# EAGLE design pocsagboardv2 (EAGLE 7.1.0)
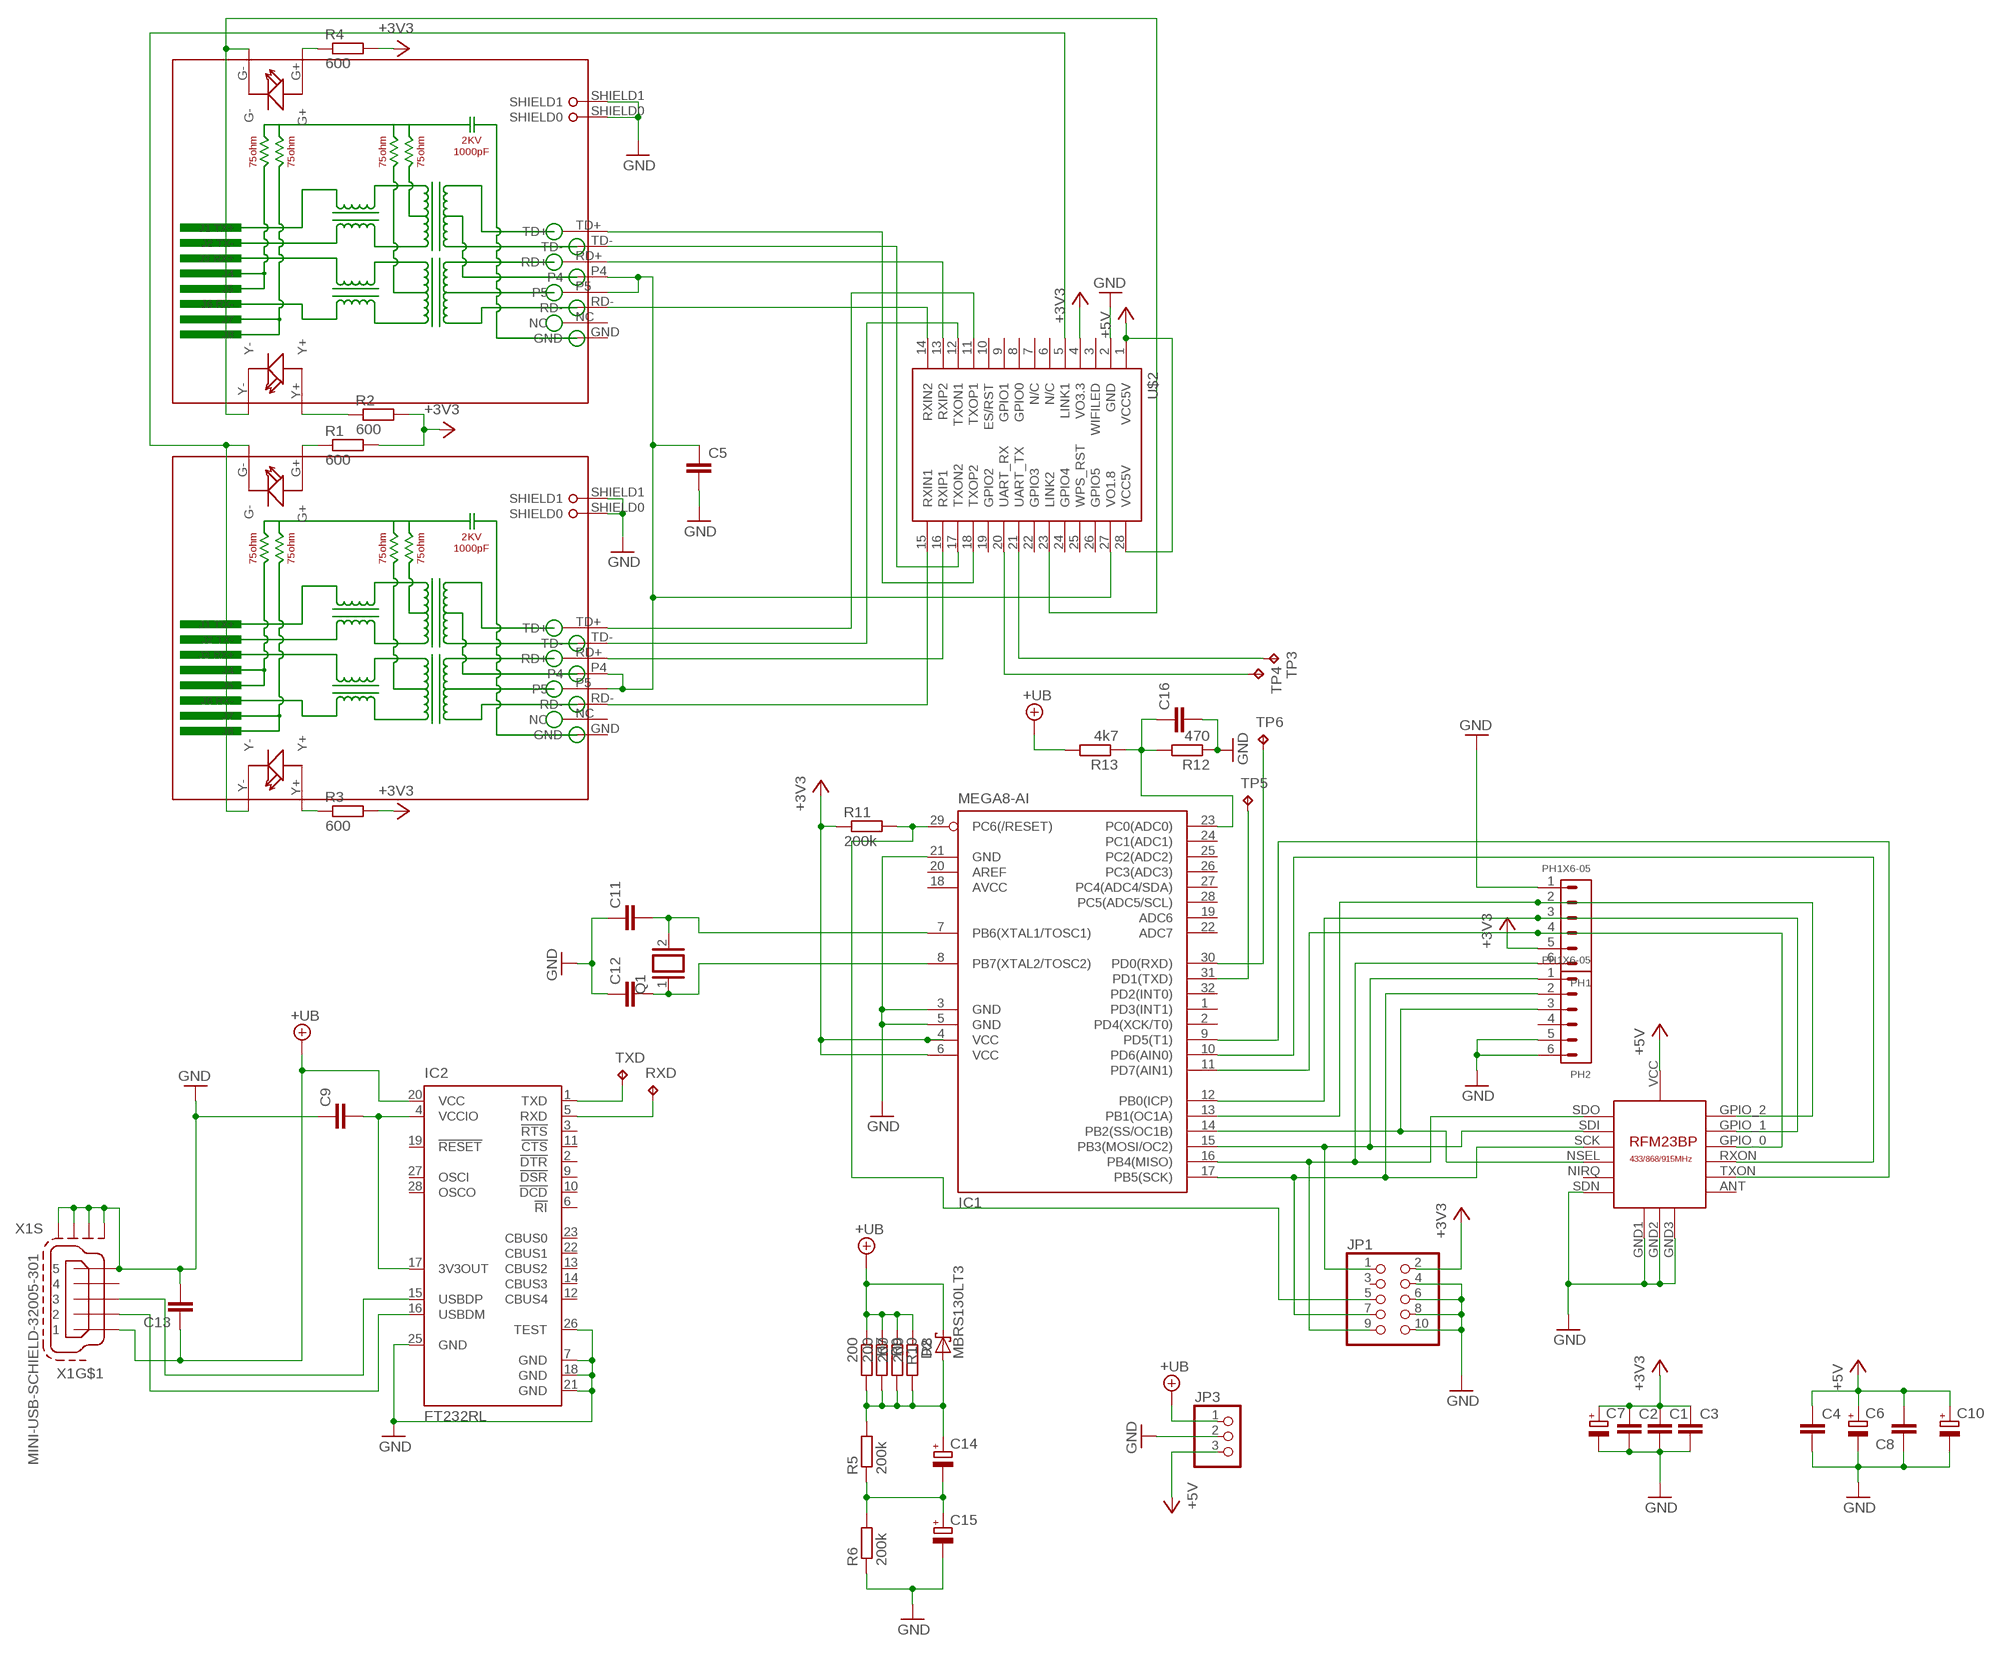
[diagram p0: schematic, sheet 1]

## Parts
C1  C-EUC1206K  [C1206K]
C2  C-EUC1206K  [C1206K]
C3  C-EUC1206K  [C1206K]
C4  C-EUC1206K  [C1206K]
C5  C-EUC1206K  [C1206K]
C6  CPOL-EU175TMP-0808  [175TMP-0808]
C7  CPOL-EU175TMP-0808  [175TMP-0808]
C8  C-EUC1206K  [C1206K]
C9  C-EUC1206K  [C1206K]
C10  CPOL-EU175TMP-0808  [175TMP-0808]
C11  C-EUC0805  [C0805]
C12  C-EUC0805  [C0805]
C13  C-EUC1206K  [C1206K]
C14  CPOL-EUSANYO_F  [SANYO-OSCON_F]
C15  CPOL-EUSANYO_F  [SANYO-OSCON_F]
C16  C-EUC1206K  [C1206K]
D2  MBRS130LT3  [SMB]
IC1  MEGA8-AI  [TQFP32-08]
IC2  FT232RL  [SSOP28]
JP1  PINHD-2X5  [2X05]
JP3  PINHD-1X3  [1X03]
PH1  PH1X6-05  [PH005-1-6]
PH2  PH1X6-05  [PH005-1-6]
Q1  XTAL/S  [QS]
R1  600  R-EU_M1206  [M1206]
R2  600  R-EU_M1206  [M1206]
R3  600  R-EU_M1206  [M1206]
R4  600  R-EU_M1206  [M1206]
R5  200k  R-EU_R1206  [R1206]
R6  200k  R-EU_R1206  [R1206]
R7  200  R-EU_R1206  [R1206]
R8  200  R-EU_R1206  [R1206]
R9  200  R-EU_R1206  [R1206]
R10  200  R-EU_R1206  [R1206]
R11  200k  R-EU_R1206  [R1206]
R12  470  R-EU_R1206  [R1206]
R13  4k7  R-EU_R1206  [R1206]
RJ1  HR911105A  [HR911105A]
RJ2  HR911105A  [HR911105A]
RXD  TPTP10SQ  [TP10SQ]
TP3  TPTP10SQ  [TP10SQ]
TP4  TPTP10SQ  [TP10SQ]
TP5  TPTP10SQ  [TP10SQ]
TP6  TPTP10SQ  [TP10SQ]
TXD  TPTP10SQ  [TP10SQ]
U$1  RFM23BP  [RFM23BP]
U$2  HLK-RM04  [HLK-RM04]
X1  MINI-USB-SCHIELD-32005-301  [32005-301]

## Nets
+3V3: C1.1 C2.1 C3.1 C7.+ IC1.4(VCC) IC1.6(VCC) JP1.2 PH1.5 R1.2 R2.2 R3.2 R4.2 R11.1 U$2.4(VO3.3)
+5V: C4.1 C6.+ C8.2 C10.+ JP3.3 U$1.VCC U$2.1(VCC5V) U$2.28(VCC5V)
+UB: C13.1 D2.C IC2.20(VCC) JP3.1 R7.1 R8.1 R9.1 R10.1 R13.2 X1.1
GND: C1.2 C2.2 C3.2 C4.2 C5.2 C6.- C7.- C8.1 C9.1 C10.- C11.1 C12.1 C13.2 C15.- C16.2 IC1.3(GND) IC1.5(GND) IC1.21(GND) IC2.7(GND) IC2.18(GND) IC2.21(GND) IC2.25(GND) IC2.26(TEST) JP1.4 JP1.6 JP1.8 JP1.10 JP3.2 PH1.1 PH2.5 PH2.6 R6.1 R12.1 RJ1.SHIELD0 RJ1.SHIELD1 RJ2.SHIELD0 RJ2.SHIELD1 U$1.GND1 U$1.GND2 U$1.GND3 U$1.SDN U$2.2(GND) X1.5 X1.M1(S:S1) X1.M2(S:S2) X1.M3(S:S3) X1.M4(S:S4)
N$1: IC1.11(PD7(AIN1)) PH1.4 U$1.GPIO_0
N$2: IC1.14(PB2(SS/OC1B)) PH2.3 U$1.NSEL
N$3: IC1.16(PB4(MISO)) JP1.9 PH1.6 U$1.SDO
N$4: IC1.15(PB3(MOSI/OC2)) JP1.1 PH2.1 U$1.SDI
N$5: IC1.17(PB5(SCK)) JP1.7 PH2.2 U$1.SCK
N$6: TP3.TP U$2.21(UART_TX)
N$7: IC1.12(PB0(ICP)) PH1.3 U$1.GPIO_1
N$8: IC1.13(PB1(OC1A)) PH1.2 U$1.GPIO_2
N$9: IC1.10(PD6(AIN0)) U$1.RXON
N$10: IC1.9(PD5(T1)) U$1.TXON
N$11: TP4.TP U$2.20(UART_RX)
N$12: RJ2.RD- U$2.14(RXIN2)
N$13: RJ2.RD+ U$2.13(RXIP2)
N$14: RJ2.TD- U$2.17(TXON2)
N$15: RJ2.TD+ U$2.18(TXOP2)
N$16: RJ1.TD- U$2.12(TXON1)
N$17: RJ1.TD+ U$2.11(TXOP1)
N$18: RJ1.RD+ U$2.16(RXIP1)
N$19: RJ1.RD- U$2.15(RXIN1)
N$20: R1.1 RJ1.G+
N$21: C5.1 RJ1.P4 RJ1.P5 RJ2.P4 RJ2.P5 U$2.27(VO1.8)
N$22: R2.1 RJ2.Y+
N$23: R4.1 RJ2.G+
N$24: R3.1 RJ1.Y+
N$25: RJ2.G- RJ2.Y- U$2.23(LINK2)
N$26: RJ1.G- RJ1.Y- U$2.5(LINK1)
N$27: IC2.16(USBDM) X1.2
N$28: C11.2 IC1.7(PB6(XTAL1/TOSC1)) Q1.2
N$29: IC2.15(USBDP) X1.3
N$30: C9.2 IC2.4(VCCIO) IC2.17(3V3OUT)
N$31: IC1.30(PD0(RXD)) TP6.TP
N$32: IC2.1(TXD) TXD.TP
N$33: IC1.31(PD1(TXD)) TP5.TP
N$34: IC2.5(RXD) RXD.TP
N$35: C16.1 IC1.23(PC0(ADC0)) R12.2 R13.1
N$36: IC1.29(PC6(/RESET)) JP1.5 R11.2
N$37: C12.2 IC1.8(PB7(XTAL2/TOSC2)) Q1.1
N$38: C14.- C15.+ R5.1 R6.2
N$40: C14.+ D2.A R5.2 R7.2 R8.2 R9.2 R10.2
Unconnected: IC1.1(PD3(INT1)) IC1.2(PD4(XCK/T0)) IC1.19(ADC6) IC1.20(AREF) IC1.22(ADC7) IC1.24(PC1(ADC1)) IC1.25(PC2(ADC2)) IC1.26(PC3(ADC3)) IC1.27(PC4(ADC4/SDA)) IC1.28(PC5(ADC5/SCL)) IC1.32(PD2(INT0)) IC2.2(!DTR) IC2.3(!RTS) IC2.6(!RI) IC2.9(!DSR) IC2.10(!DCD) IC2.11(!CTS) IC2.12(CBUS4) IC2.13(CBUS2) IC2.14(CBUS3) IC2.19(!RESET) IC2.22(CBUS1) IC2.23(CBUS0) IC2.27(OSCI) IC2.28(OSCO) JP1.3 PH2.4 RJ1.GND RJ1.NC RJ2.GND RJ2.NC U$1.ANT U$1.NIRQ U$2.3(WIFILED) U$2.6(N/C) U$2.7(N/C) U$2.8(GPIO0) U$2.9(GPIO1) U$2.10(ES/RST) U$2.19(GPIO2) U$2.22(GPIO3) U$2.24(GPIO4) U$2.25(WPS_RST) U$2.26(GPIO5) X1.4

## Power pins joined to a net without a drawn wire
AVCC: IC1.18(AVCC)

## Library data of the parts
C1-C5 C8 C9 C11-C13 C16 = rcl:C-EU: CAPACITOR, European symbol
C6 C7 C10 C14 C15 = rcl:CPOL-EU: POLARIZED CAPACITOR, European symbol
D2 = diode:MBRS130LT3: Schottky Power Rectifier Source: http://www.onsemi.com/pub/Collateral/MBRS130LT3-D.PDF
IC1 = atmel:MEGA8: MICROCONTROLLER 8 Kbytes FLASH, 1 kbytes SRAM, 512 bytes EEPROM, USART, 6-channel 10 bit ADC, 2-channel 8 bit ADC Pin compatible with Atmega48, ATMega88, ATMega168 Source: avr.lbr; MPN: ATMEGA8-16AU; OC_FARNELL: 9171371; OC_NEWARK: 73M8863
IC2 = ftdichip:FT232R: Source: http://www.ftdichip.com/Documents/DataSheets/DS_FT232R_v104.pdf; MPN: FT232RL; OC_FARNELL: 1146032; OC_NEWARK: 91K9918
JP1 = pinhead:PINHD-2X5: PIN HEADER
JP3 = pinhead:PINHD-1X3: PIN HEADER
PH1 PH2 = pel_hdr:PH1X6
Q1 = special:XTAL/S: CRYSTAL
R1-R13 = rcl:R-EU_: RESISTOR, European symbol
RJ1 RJ2 = CONNECTER:HR911105A
RXD TP3-TP6 TXD = testpad:TP: Test pad
U$1 = RFM23BP:RFM23BP: HopeRF RFM23BP Library by: http://projects.weber-itam.de
U$2 = solderandflux:HLK-RM04
X1 = con-cypressindustries:MINI-USB-SCHIELD-: MINI USB-B Conector Source: www.cypressindustries.com; OC_FARNELL: unknown; OC_NEWARK: unknown

## Board
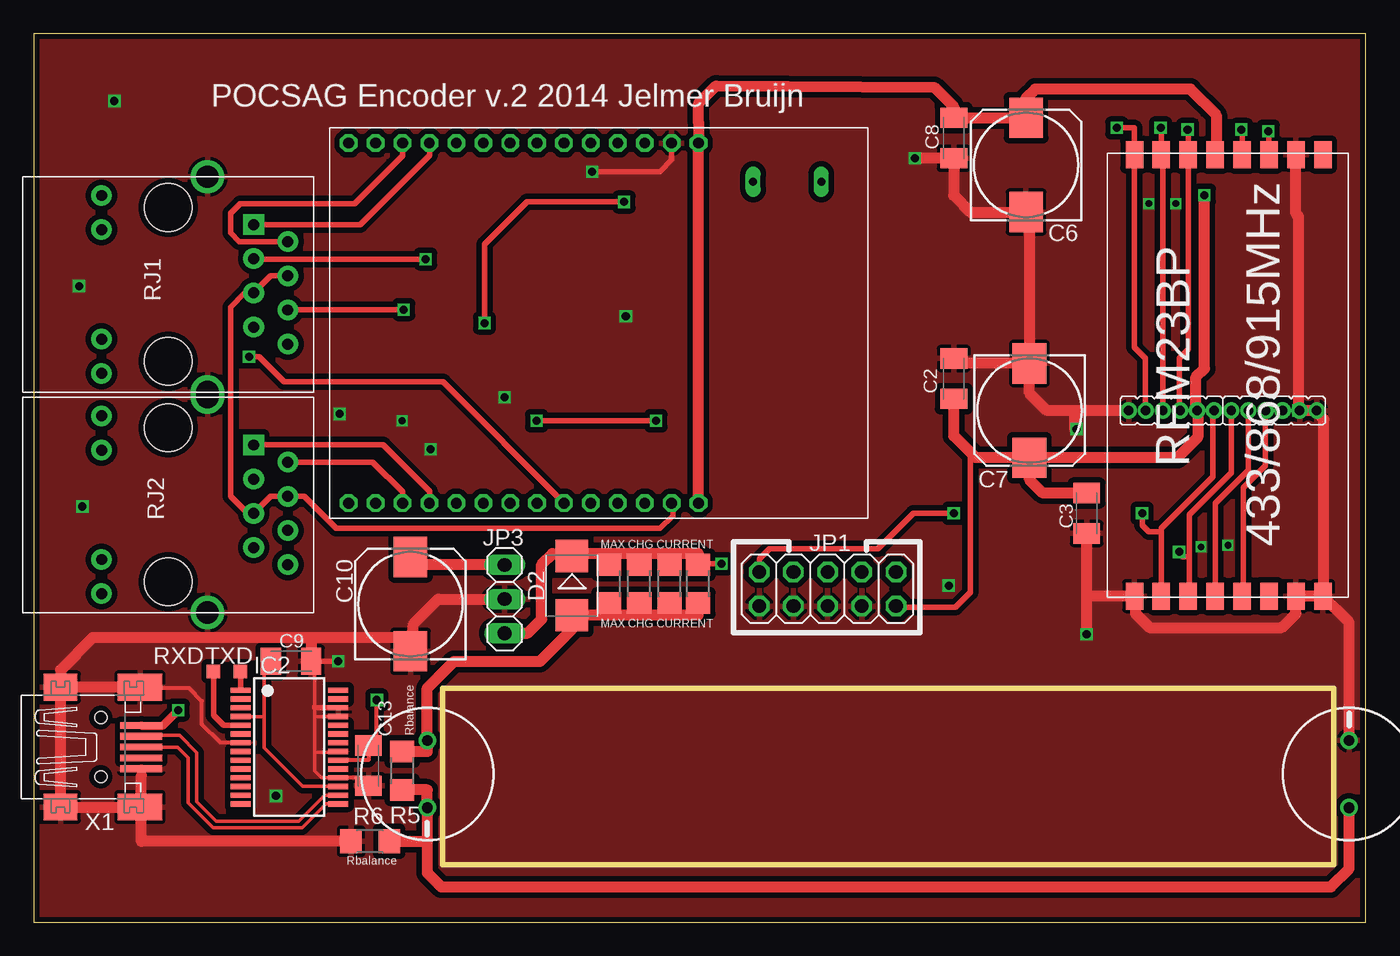
[diagram p1: board, top side]
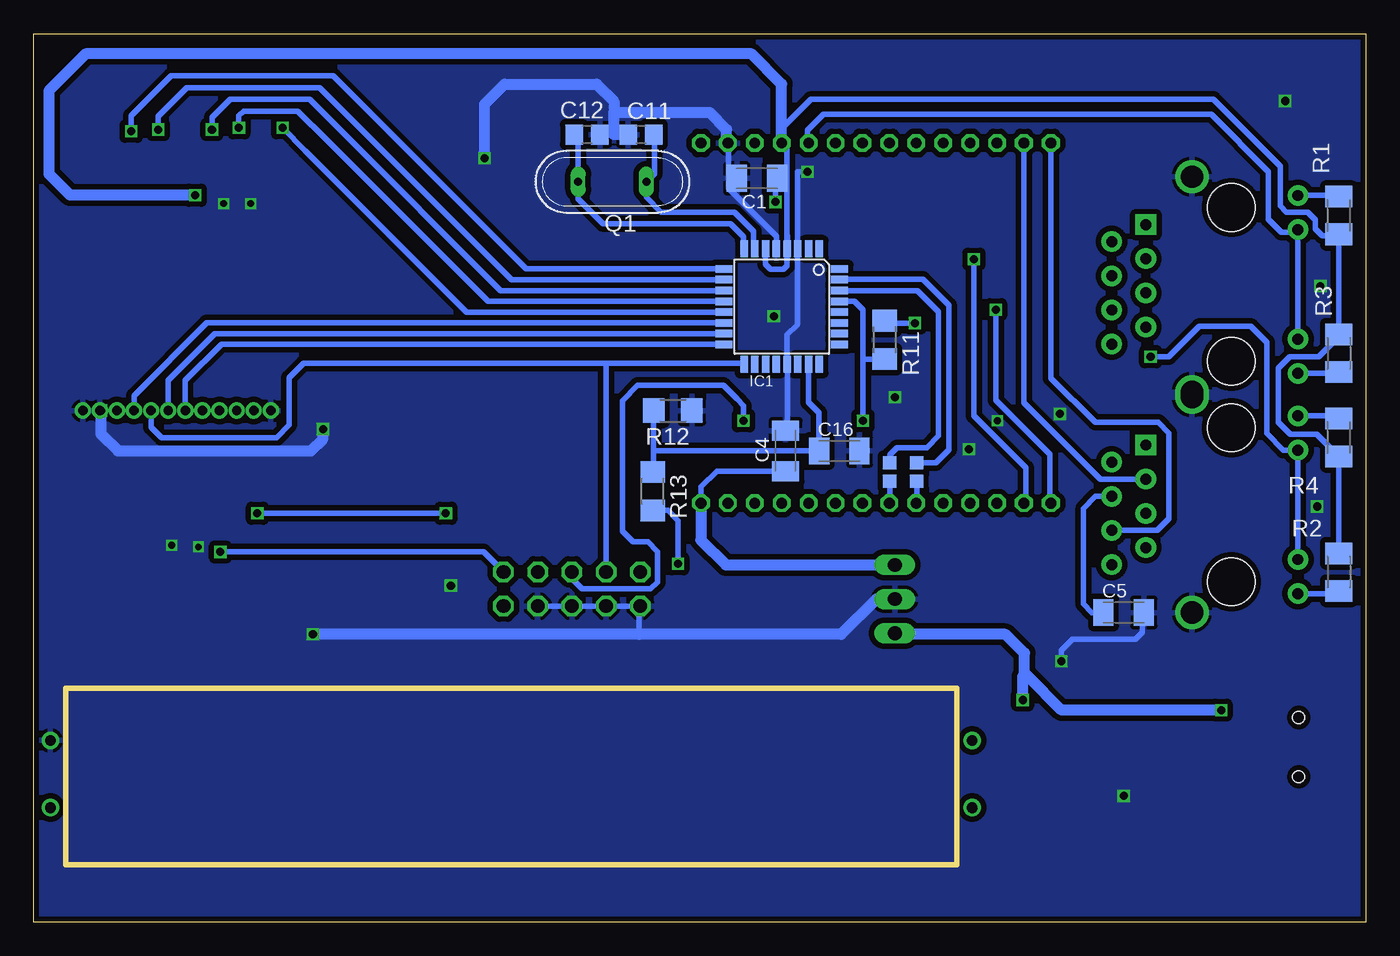
[diagram p2: board, bottom side, seen from below]

Size 99 x 66 mm. Coordinates in mm from the lower left corner, seen from the top.
Outline: 0,0 99,0 99,66 0,66 0,0
Copper layers (1*16): Top 0.035mm / dielectric 1.5mm / Bottom 0.035mm
Design rules "dirt_cheap_dirty_boards.v1": minimum track width 5mil, minimum drill 12mil, track to track 5mil, track to pad 5mil, pad to pad 5mil, via to via 5mil, smd to smd 0mil, copper to edge 10mil, drill to drill 10mil, minimum pad ring 10mil, minimum via ring 6mil, stop-mask expansion 2mil, vias tented up to drill 25mil, thermal gap 10mil
Milling: 4 lines

### Footprints (pad centres in the part's own frame; a part is rotated, then mirrored left to right if it is on the bottom)
C1206K = smd 1.5 x 2: 1 -1.5,0; 2 1.5,0
175TMP-0808 = smd 3 x 2.5: + 3.5,0; - -3.5,0
C0805 = smd 1.3 x 1.5: 1 -0.95,0; 2 0.95,0
SANYO-OSCON_F = drill 0.8 pad 1.27: + 2.5,0; - -2.5,0
SMB = smd 2.4 x 2.4: A 2.2,0; C -2.2,0
TQFP32-08 = smd 1.27 x 0.559: 1 -4.293,2.8; 2 -4.293,2; 3 -4.293,1.2; 4 -4.293,0.4; 5 -4.293,-0.4; 6 -4.293,-1.2; 7 -4.293,-2; 8 -4.293,-2.8; 17 4.293,-2.8; 18 4.293,-2; 19 4.293,-1.2; 20 4.293,-0.4; 21 4.293,0.4; 22 4.293,1.2; 23 4.293,2; 24 4.293,2.8 | smd 0.559 x 1.27: 9 -2.8,-4.293; 10 -2,-4.293; 11 -1.2,-4.293; 12 -0.4,-4.293; 13 0.4,-4.293; 14 1.2,-4.293; 15 2,-4.293; 16 2.8,-4.293; 25 2.8,4.293; 26 2,4.293; 27 1.2,4.293; 28 0.4,4.293; 29 -0.4,4.293; 30 -1.2,4.293; 31 -2,4.293; 32 -2.8,4.293
SSOP28 = smd 0.4 x 1.5: 1 -4.225,-3.625; 2 -3.575,-3.625; 3 -2.925,-3.625; 4 -2.275,-3.625; 5 -1.625,-3.625; 6 -0.975,-3.625; 7 -0.325,-3.625; 8 0.325,-3.625; 9 0.975,-3.625; 10 1.625,-3.625; 11 2.275,-3.625; 12 2.925,-3.625; 13 3.575,-3.625; 14 4.225,-3.625; 15 4.225,3.625; 16 3.575,3.625; 17 2.925,3.625; 18 2.275,3.625; 19 1.625,3.625; 20 0.975,3.625; 21 0.325,3.625; 22 -0.325,3.625; 23 -0.975,3.625; 24 -1.625,3.625; 25 -2.275,3.625; 26 -2.925,3.625; 27 -3.575,3.625; 28 -4.225,3.625
2X05 = drill 1.016 octagon: 1 -5.08,-1.27; 2 -5.08,1.27; 3 -2.54,-1.27; 4 -2.54,1.27; 5 0,-1.27; 6 0,1.27; 7 2.54,-1.27; 8 2.54,1.27; 9 5.08,-1.27; 10 5.08,1.27
1X03 = drill 1.016 long: 1 -2.54,0; 2 0,0; 3 2.54,0
PH005-1-6 = drill 0.7 pad 1.016: 1 0,0; 2 1.27,0; 3 2.54,0; 4 3.81,0; 5 5.08,0; 6 6.35,0
QS = drill 0.61 long: 1 -2.54,0; 2 2.54,0
M1206 = smd 1.6 x 2: 1 -1.4,0; 2 1.4,0
R1206 = smd 1.6 x 1.803: 1 -1.422,0; 2 1.422,0
HR911105A = drill 0.813 pad 1.524: G+ 4.953,-6.604; G- 4.953,-4.064; GND -8.89,4.445; NC -6.35,3.175; P4 -8.89,-0.635; P5 -6.35,0.635; RD+ -6.35,-1.905; RD- -8.89,1.905; TD- -8.89,-3.175; Y+ 4.953,6.604; Y- 4.953,4.064 | drill 1.651 pad 2.159: SHIELD0 -2.921,8.001; SHIELD1 -2.921,-8.001 | drill 0.813 pad 1.524 square: TD+ -6.35,-4.445 | hole 3.556: 0,-5.715; 0,5.715
TP10SQ = smd 1 x 1: TP 0,0
RFM23BP = smd 2 x 1.3: ANT 16.9,-7.5; GND1 -15.9,6.5; GND2 -15.9,-7.5; GND3 16.9,-5.5; GPIO_0 16.9,2.5; GPIO_1 16.9,4.5; GPIO_2 16.9,6.5; NIRQ -15.9,-3.5; NSEL -15.9,-1.5; RXON 16.9,-1.5; SCK -15.9,0.5; SDI -15.9,2.5; SDN -15.9,-5.5; SDO -15.9,4.5; TXON 16.9,-3.5; VCC 16.9,0.5
HLK-RM04 = drill 0.8 octagon: 1 1.125,-12.59; 2 1.125,-14.59; 3 1.125,-16.59; 4 1.125,-18.59; 5 1.125,-20.59; 6 1.125,-22.59; 7 1.125,-24.59; 8 1.125,-26.59; 9 1.125,-28.59; 10 1.125,-30.59; 11 1.125,-32.59; 12 1.125,-34.59; 13 1.125,-36.59; 14 1.125,-38.59; 15 27.875,-38.59; 16 27.875,-36.59; 17 27.875,-34.59; 18 27.875,-32.59; 19 27.875,-30.59; 20 27.875,-28.59; 21 27.875,-26.59; 22 27.875,-24.59; 23 27.875,-22.59; 24 27.875,-20.59; 25 27.875,-18.59; 26 27.875,-16.59; 27 27.875,-14.59; 28 27.875,-12.59
32005-301 = smd 3.1 x 0.5: 1 3,1.6; 2 3,0.8; 3 3,0; 4 3,-0.8; 5 3,-1.6 | smd 2.5 x 2: M1 -3,-4.45; M2 -3,4.45 | smd 3.3 x 2: M3 2.9,4.45; M4 2.9,-4.45 | hole 0.9: 0,2.2; 0,-2.2

### Placement (x,y rotation side)
C1  45.25,55.25 180 bottom
C2  68.38,40.38 90 top
C3  78.25,30.38 270 top
C4  43.12,35 90 bottom
C5  18,23 0 bottom
C6  73.75,56.25 90 top
C7  74,38 270 top
C8  68.38,58.25 90 top
C9  19.12,19.38 180 top
C10  28,23.62 90 top
C11  53.88,58.5 0 bottom
C12  57.88,58.5 180 bottom
C13  24.88,11.62 270 top
C14  29.25,11 90 top
C15  97.75,11 270 top
C16  39.12,35 0 bottom
D2  40,25 270 top
IC1  43.41,45.72 270 bottom
IC2  19,13 270 top
JP1  59,24.75 180 top
JP3  35,24 90 top
PH1  81.38,38 0 top
PH2  89,38 0 top
Q1  56,55 0 bottom
R1  2,52.5 270 bottom
R2  2,26 90 bottom
R3  2,42.25 90 bottom
R4  2,36 270 bottom
R5  27.38,11.25 90 top
R6  25,6 0 top
R7  42.75,25.12 270 top
R8  47.25,25.12 270 top
R9  45,25.12 270 top
R10  49.38,25.12 270 top
R11  35.75,43.25 270 bottom
R12  51.5,38 180 bottom
R13  53,32 270 bottom
RJ1  10,47.38 180 top
RJ2  10,31 180 top
RXD  13.38,18.62 0 top
TP3  35.38,32.75 0 bottom
TP4  33.38,32.75 0 bottom
TP5  33.38,34.12 0 bottom
TP6  35.38,34.12 0 bottom
TXD  15.38,18.62 0 top
U$1  88.3,40.12 90 top
U$2  62,59 270 top
X1  5,13 0 top

### Tracks (layer width: path | path; a pad name or v marks a point on that pad's centre or on a via)
+3V3  (via drill 0.6)
  Top 0.406: JP1.2 64.08,23.38 68.5,23.38 69.62,24.5 69.62,34.5 70,34.5 | v33.5,44.5 33.5,50.34 36.66,53.5 v43.88,53.5
  Top 0.813: C7.+ 85,34.5 86.5,36.01 86.5,38 PH1.5 86.38,38 86.38,40.5 87,41.12 v87,54 | C7.+ 70,34.5 68.38,36.13 C2.1 | C3.1 75,31.88 74,32.88 C7.+
  Bottom 0.406: R2.2 R4.2 3.65,36.25 5.6,36.25 6.5,37.15 6.5,41.16 5.66,42 3.5,42 2.12,43.38 2.12,43.65 R3.2 R1.2 2,51 3.23,51 3.75,51.52 3.75,52.19 4.31,52.75 5.92,52.75 6.38,53.2 6.38,56.15 11.35,61.12 41.24,61.12 43.38,58.99 43.38,57.88 U$2.4 43.01,57.88 43.01,55.25 | 43.01,55.25 IC1.4 | IC1.4 43,51 | 43.01,55.25 C1.1 43.88,55.25 v43.88,53.5 | IC1.6 44.62,50.01 44.62,48.88 44.25,48.5 43.28,48.5 43.01,48.77 IC1.4 | R11.1 35.75,44.5 v33.5,44.5
  Bottom 0.813: v87,54 96.29,54 97.88,55.58 97.88,61.76 95.13,64.5 45.65,64.5 43.41,62.26 U$2.4
+5V
  Top 0.406: U$1.VCC 87.75,57.02
  Top 0.813: U$2.28 U$2.1 49.41,59.36 49.42,60.83 50.72,62.12 66.93,62.01 68.38,60.55 C8.2 C6.+ 73.75,61.2 74.42,61.88 85.96,61.88 87.88,59.96 87.88,57.02 U$1.VCC | JP3.3 28.25,26.54 C10.+
  Bottom 0.406: U$2.28 49.41,32.32 48.23,33.5 C4.1
  Bottom 0.813: U$2.28 49.41,28.38 47.57,26.54 JP3.3
+UB  (via drill 0.6)
  Top 0.305: IC2.20 24.88,12.03 C13.1 25.5,13.12 v25.5,16.5
  Top 0.406: v51.12,26.62 49.38,26.62 R10.1
  Top 0.61: X1.1 9.6,14.6 v10.75,15.75
  Top 0.813: JP3.1 36.71,21.46 37.75,22.5 37.75,26.57 38.55,27.38 40,27.38 | 40,27.38 D2.C | 45,27.38 42.75,27.38 | 42.75,27.38 40,27.38 | R7.1 42.75,27.38 | 47.25,27.38 45,27.38 | 45,27.38 R9.1 | R10.1 49.38,27.38 47.25,27.38 | 47.25,27.38 R8.1
  Bottom 0.406: R13.2 51.87,30.58 51.12,29.83 v51.12,26.62
  Bottom 0.813: v10.75,15.75 22.61,15.75 25.12,18.26 | 25.12,18.26 25.38,18.51 25.38,19.98 26.77,21.38 35,21.38 JP3.1 | v25.5,16.5 25.5,18.26 25.12,18.26
GND  (via drill 0.5, 0.6)
  Top 0.254: 20.88,15.25 20.88,16 20.88,19.38 C9.1 20.62,20.44 | 20.88,15.25 22.62,15.25 IC2.25 | 20.88,15.25 20.88,12.62 | 20.88,12.62 22.62,12.62 IC2.21 | IC2.18 21.39,10.72 20.88,11.23 20.88,12.62
  Top 0.305: IC2.7 13.89,13.32 12.5,14.71 12.5,16.42 11.55,17.38 7.9,17.38 X1.M3 | IC2.18 22.62,10.75 24.88,10.75 C13.2
  Top 0.406: 94.12,38 PH2.5 | v22.62,19.38 C9.1 | v41.5,55.75 46.54,55.75 47.41,56.62 U$2.2 | IC2.26 20.88,15.93 20.88,16
  Top 0.61: 8,10.88 X1.5
  Top 0.813: PH1.1 77.38,38 | 77.38,38 75.31,38 74,39.3 C7.- | U$1.GND2 U$1.SDN 93.8,22.93 92.75,21.88 82.94,21.88 81.88,22.94 81.88,24.22 U$1.GND1 78.25,24.22 | C7.- 68.38,41.5 C2.2 | U$1.GND2 95.88,24.22 95.88,37.35 95.35,37.88 PH2.6 PH2.5 v94,38 94,52.42 93.8,52.62 U$1.GND3 93.75,57.02 | v77.5,36.62 77.38,36.62 77.38,38 | X1.M2 X1.M1 X1.M4 8,8.55 | X1.M3 X1.M2 | 78.25,24.22 C3.2 | C7.- 74,52.75 C6.- 69.61,52.75 68.38,53.98 C8.1 v65.5,56.75 | C10.- 28.25,22.18 30.07,24 JP3.2 | C10.- 28,19.75 | C10.- 28,21.12 20.62,21.12 | 20.62,21.12 4.4,21.12 2,18.72 X1.M2 | 20.62,21.12 C9.1 | C15.- 97.75,22.27 U$1.GND2 | R6.1 8,6 8,8.55 | 8,8.55 8,10.88 | v78.25,21.38 78.25,24.22
  Bottom 0.406: U$2.2 47.38,57.88 47.38,55.25 | 47.38,55.25 47.38,54.5 43.81,50.93 IC1.5 | C1.2 47.38,55.25 | C5.2 16.62,23 16.62,21.52 17.14,21 21.82,21 22.62,20.2 v22.62,19.38 | C11.1 C12.1 | IC1.3 42.25,50.01 | 42.25,50.01 42.25,44.38 43.01,43.62 IC1.21 43,37.12 43.12,37.12 C4.2 | 42.25,50.01 42.25,55.75 v41.5,55.75 | JP1.4 JP1.6 JP1.8 JP1.10 54,23.48 54,21.38
  Bottom 0.813: U$2.2 47.5,57.88 47.5,58.88 48.75,60.12 55.88,60.12 | C11.1 55.88,58.5 55.88,60.12 | v94,38 94,36.27 92.72,35 78.38,35 77.5,35.88 v77.5,36.62 | v65.5,56.75 65.5,60.74 63.99,62.25 57.16,62.25 55.88,60.96 55.88,60.12 | JP3.2 36.38,24 39,21.38 54,21.38 v78.25,21.38
  other vias: 6,61 68,25 29.5,35.12 18,9.38 35,39 3.38,47.25 3.62,30.88 22.75,37.75 27.38,37.25 82.88,53.38 84.88,53.38 86.75,27.88 88.75,28 44,45
  pour Top (isolate 0.406): 0,66 99,66 99,0 0,0
  pour Bottom (isolate 0.406): 0,66 99,66 99,0 0,0
N$1  (via drill 0.6)
  Top 0.406: 85,38 PH1.4 85.12,38 85.12,41.88 85.8,42.55 U$1.GPIO_0 85.8,58.88 v85.75,58.88
  Bottom 0.406: v85.75,58.88 85.75,59.77 84.4,61.12 78.5,61.12 76.3,58.92 64.3,46.92 IC1.11
N$2
  Top 0.406: PH2.3 91.54,33.91 89.88,32.25 89.88,24.22 U$1.NSEL
  Bottom 0.406: PH2.3 91.54,39.1 86.12,44.52 IC1.14
N$3  (via drill 0.6)
  Top 0.406: U$1.SDO 83.8,29 | 83.8,29 83.8,29.25 87.62,33.08 87.62,38 PH1.6 | JP1.9 53.92,26.98 54.69,27.75 62.75,27.75 65.38,30.38 v68.38,30.38 | v82.38,30.38 82.38,29.5 82.88,29 83.8,29
  Bottom 0.406: PH1.6 87.72,40.24 85.04,42.92 IC1.16 | v68.38,30.38 v82.38,30.38
N$4  (via drill 0.6)
  Top 0.406: 85.88,27.12 85.88,24.22 U$1.SDI | 85.88,27.12 85.88,30.25 89,33.38 PH2.1 | v85.12,27.5 85.12,27.41 85.41,27.12 85.88,27.12
  Bottom 0.406: PH2.1 89,40.26 85.54,43.72 IC1.15 | JP1.1 65.56,27.5 v85.12,27.5
N$5
  Top 0.406: U$1.SCK 87.8,31.12 90.25,33.58 90.25,38 PH2.2
  Bottom 0.406: 56.46,41.5 78.92,41.5 80,40.42 80,36.95 80.95,36 89.5,36 90.27,36.77 PH2.2 | 56.46,41.5 46.21,41.5 IC1.17 | JP1.7 56.46,41.5
N$6
  Bottom 0.406: U$2.21 35.38,31.12 TP3.TP
N$7  (via drill 0.6)
  Top 0.406: PH1.3 83.92,57.02 U$1.GPIO_1 83.8,59 v83.75,59
  Bottom 0.406: v83.75,59 83.75,59.9 83.4,60.25 79.38,60.25 77.25,58.12 65.25,46.12 IC1.12
N$8  (via drill 0.6)
  Top 0.406: PH1.2 82.62,38 82.62,41.88 81.8,42.7 U$1.GPIO_2 81.8,59 v80.5,59
  Bottom 0.406: v80.5,59 78.82,57.32 66.82,45.32 IC1.13
N$9  (via drill 0.6)
  Top 0.406: v89.75,58.88 89.8,58.88 U$1.RXON
  Bottom 0.406: v89.75,58.88 89.75,59.86 87.61,62 77.75,62 75.47,59.72 63.47,47.72 IC1.10
N$10  (via drill 0.6)
  Top 0.406: v91.75,58.75 91.8,58.75 U$1.TXON
  Bottom 0.406: v91.75,58.75 91.75,59.89 88.77,62.88 76.75,62.88 74.39,60.52 62.4,48.52 IC1.9
N$11
  Bottom 0.406: U$2.20 33.38,31.12 TP4.TP
N$12
  Bottom 0.406: RJ2.RD- 15.51,29.09 14.62,29.98 14.62,36.33 15.43,37.12 20.12,37.12 23.41,40.42 U$2.14
N$13
  Bottom 0.406: RJ2.RD+ 19.74,32.91 25.41,38.58 U$2.13
N$14
  Top 0.406: RJ2.TD- 25.2,34.17 27.41,31.96 U$2.17
N$15
  Top 0.406: RJ2.TD+ 25.97,35.45 29.41,32.01 U$2.18
N$16
  Top 0.406: RJ1.TD- 15.28,50.55 14.62,51.21 14.62,52.67 15.33,53.38 23.87,53.38 27.41,56.92 U$2.12
N$17
  Top 0.406: RJ1.TD+ 24.27,51.82 29.41,56.96 U$2.11
N$18  (via drill 0.6)
  Top 0.406: v29.12,49.25 16.35,49.25 RJ1.RD+
  Bottom 0.406: U$2.16 25.25,31.12 25.25,33.75 29.12,37.62 v29.12,49.25
N$19  (via drill 0.6)
  Top 0.406: v27.5,45.5 18.89,45.5 RJ1.RD-
  Bottom 0.406: U$2.15 23.5,31.12 23.5,34.75 27.5,38.75 v27.5,45.5
N$20
  Bottom 0.406: RJ1.G+ 2,53.98 R1.1
N$21
  Top 0.406: RJ1.P4 17.62,48.01 RJ1.P5 15.69,46.74 14.62,45.67 14.62,31.65 15.78,30.5 16.35,30.5 RJ2.P5 17.62,31.64 RJ2.P4 18.89,31.62 20.12,31.62 21,30.74 22.49,29.25 46.55,29.25 47.5,30.2 47.5,31.12 U$2.27
  Bottom 0.406: C5.1 20.36,23 21,23.64 21,30.71 20.09,31.62 18.89,31.62 RJ2.P4
N$22
  Bottom 0.406: RJ2.Y+ 2,24.4 R2.1
N$23
  Bottom 0.406: RJ2.G+ 2,37.6 R4.1
N$24
  Bottom 0.406: RJ1.Y+ 2,40.77 R3.1
N$25  (via drill 0.6)
  Top 0.406: v16,42 16.75,42 18.62,40.12 30.41,40.12 U$2.23
  Bottom 0.406: RJ2.Y- RJ2.G- 6.12,35.06 7.38,36.31 7.38,43.06 8.56,44.25 12.38,44.25 14.62,42 v16,42
N$26
  Bottom 0.406: U$2.5 41.5,57.88 41.5,58.82 40.32,60 11.5,60 7.25,55.75 7.25,52.23 6.27,51.25 5.05,51.25 | RJ1.G- 5.05,51.25 | 5.05,51.25 RJ1.Y-
N$27
  Top 0.254: IC2.16 21.62,9.43 20.5,8.31 19.69,7.5 13.58,7.5 12.12,8.96 12.12,12.59 10.84,13.88 8,13.88 X1.2
N$28
  Bottom 0.406: IC1.7 45.5,50.01 45.5,51.34 46.91,52.75 52.38,52.75 53.46,53.84 Q1.2 52.88,55.59 52.88,58.5 C11.2
N$29
  Top 0.254: IC2.15 21.73,8.78 21,8.05 19.95,7 13.36,7 11.5,8.86 11.5,12.21 10.71,13 X1.3
N$30
  Top 0.254: IC2.17 20,10.07 17.12,12.95 17.12,15.25 | 17.12,15.25 15.38,15.25 IC2.4 | C9.2 17.12,19.38 17.12,15.25
N$31
  Bottom 0.406: IC1.30 33.34,46.92 31.75,45.33 31.75,36.12 32.62,35.25 34.86,35.25 35.38,34.73 TP6.TP
N$32
  Top 0.406: IC2.1 TXD.TP
N$33
  Bottom 0.406: TP5.TP 31.95,34.12 31,35.08 31,45.84 32.91,47.75 39.12,47.75 IC1.31
N$34
  Top 0.406: IC2.5 14.13,14.62 13.38,15.38 RXD.TP
N$35
  Bottom 0.406: R13.1 52.92,33.42 52.92,35 | 52.92,35 R12.2 | IC1.23 41.41,38.62 40.62,37.84 C16.1 52.92,35
N$36  (via drill 0.6)
  Top 0.406: v46.25,37.25 v37.38,37.25
  Bottom 0.406: R11.2 37.38,41.83 | 37.38,41.83 37.38,45.5 38,46.12 IC1.29 | JP1.5 59,25.51 58.24,24.75 53.14,24.75 52.62,25.27 52.62,27.52 53.35,28.25 54.46,28.25 55.25,29.04 55.25,38.74 54.12,39.88 47.75,39.88 46.75,38.88 46.25,38.38 v46.25,37.25 | v37.38,37.25 37.38,41.83
N$37
  Bottom 0.406: IC1.8 46.25,50.01 46.25,50.92 47.2,51.88 56.68,51.88 58.54,53.73 Q1.1 58.54,58.5 C12.2
N$38
  Top 0.813: 29.25,6 C14.- 29.25,9.83 R5.1 | 29.25,6 29.25,3.66 30.28,2.62 96.4,2.62 97.75,3.97 C15.+ | R6.2 29.25,6
N$40
  Top 0.813: D2.A 40.7,22.8 | R7.2 42.75,22.8 | 42.75,22.8 D2.A | R9.2 45,22.8 | 45,22.8 42.75,22.8 | D2.A 40,21.75 37.62,19.38 31.24,19.38 29.25,17.38 C14.+ 29.25,12.67 R5.2 | R8.2 47.25,22.8 | 47.25,22.8 45,22.8 | R10.2 49.38,22.8 47.25,22.8

### Text on the board
tNames: POCSAG Encoder v.2 2014 Jelmer Bruijn | MAX CHG CURRENT | MAX CHG CURRENT | Rbalance | Rbalance